# EAGLE design button (EAGLE 7.2.0)
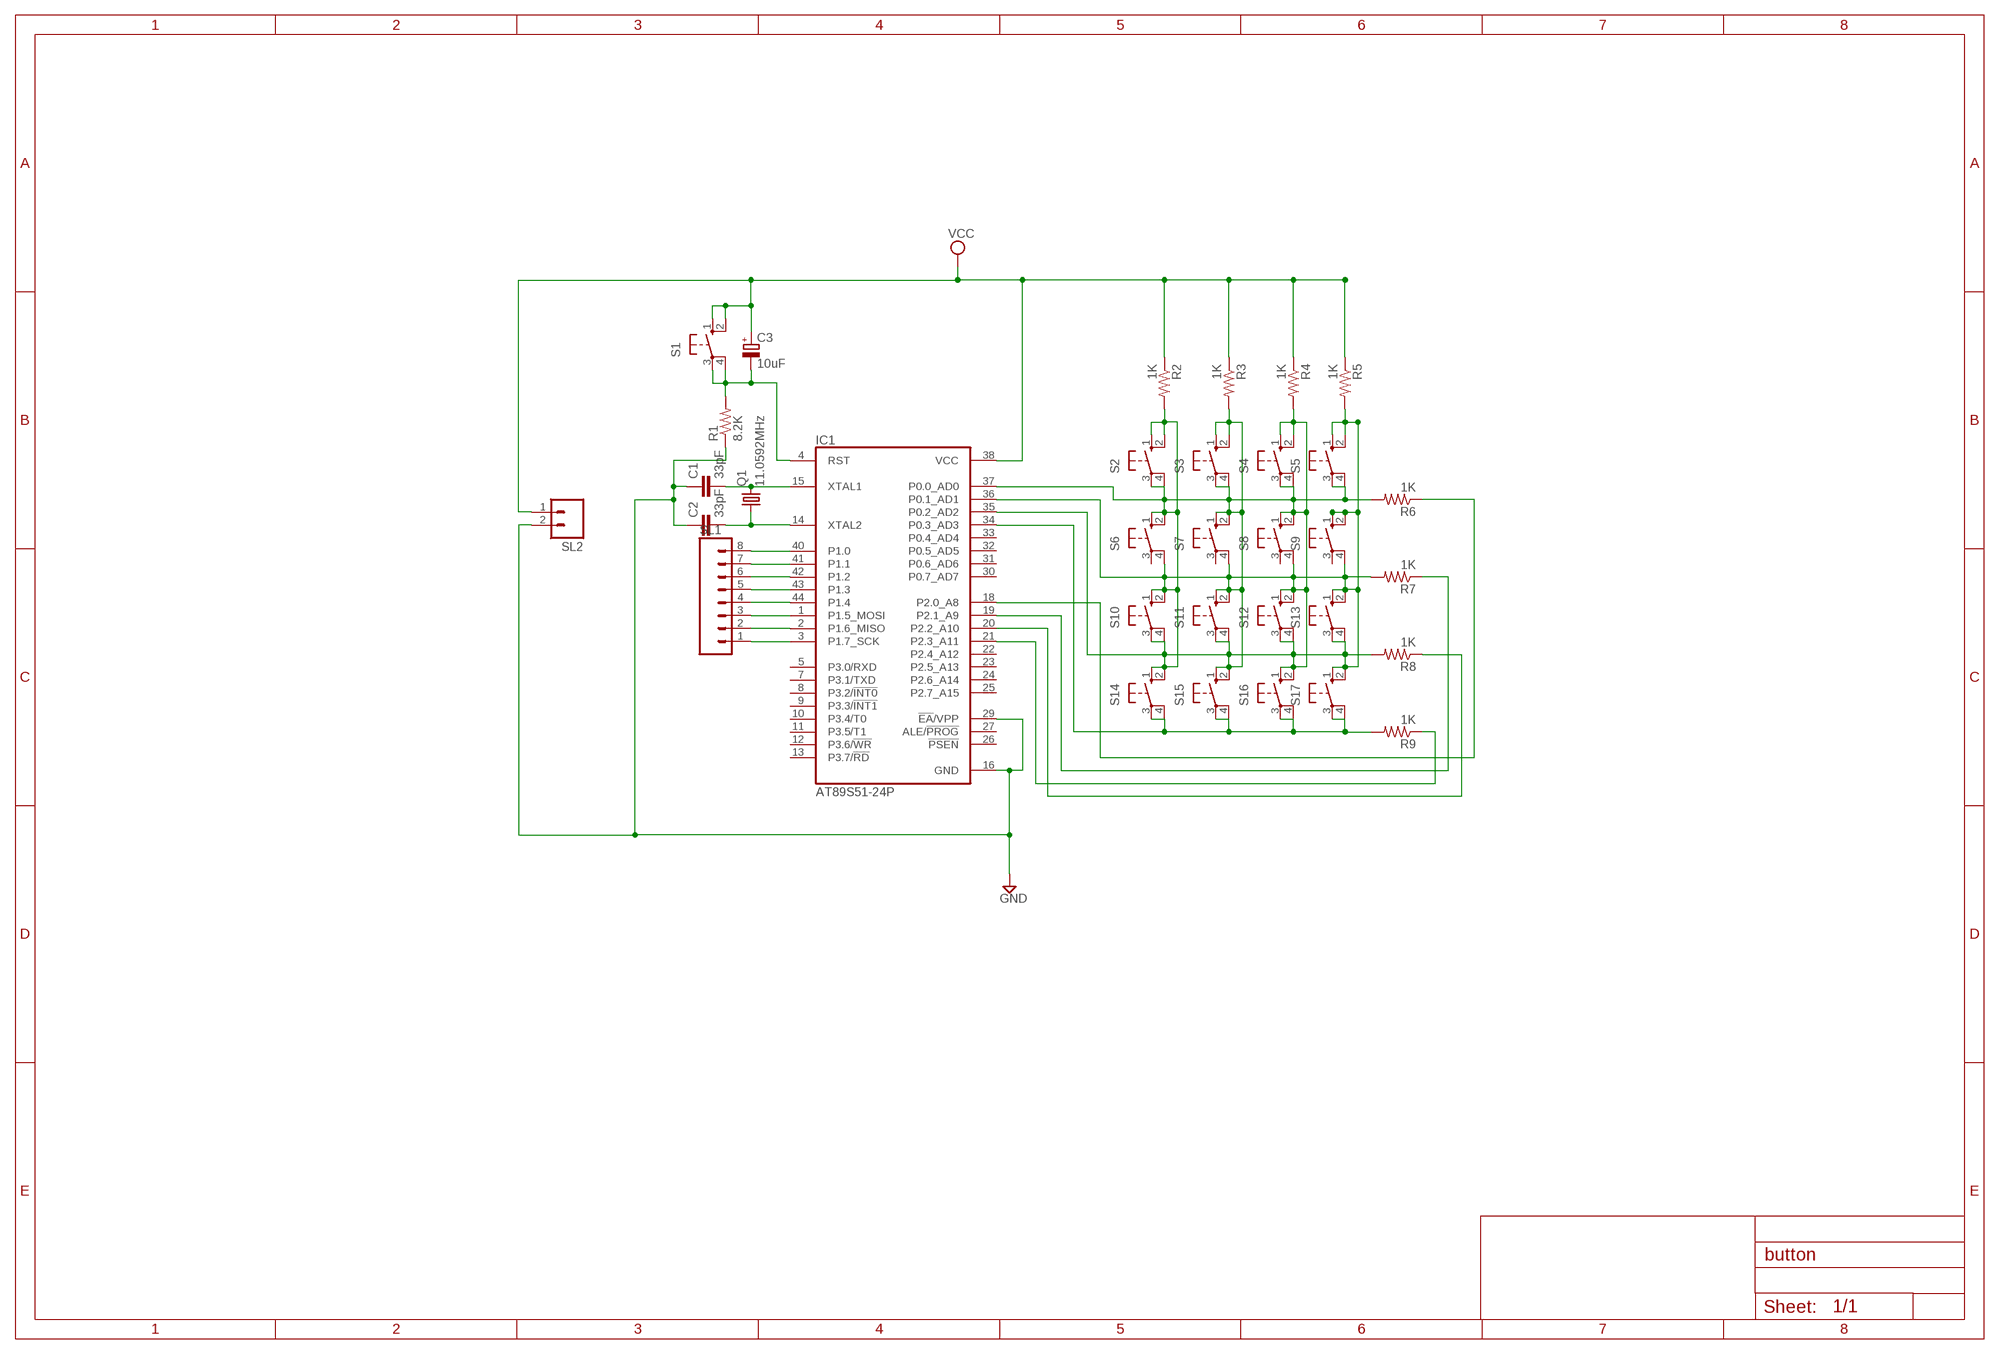
[diagram p0: schematic, sheet 1]

## Parts
C1  33pF  C-EUC1206K  [C1206K]
C2  33pF  C-EUC1206K  [C1206K]
C3  10uF  CPOL-EU140CLH-1010  [140CLH-1010]
IC1  AT89S51-24P  [TQFP44]
Q1  11.0592MHz  CRYSTALTC26V  [TC26V]
R1  8.2K  R-US_R1206  [R1206]
R2  1K  R-US_M1206  [M1206]
R3  1K  R-US_M1206  [M1206]
R4  1K  R-US_M1206  [M1206]
R5  1K  R-US_M1206  [M1206]
R6  1K  R-US_M1206  [M1206]
R7  1K  R-US_M1206  [M1206]
R8  1K  R-US_M1206  [M1206]
R9  1K  R-US_M1206  [M1206]
S1  10-XX  [B3F-10XX]
S2  10-XX  [B3F-10XX]
S3  10-XX  [B3F-10XX]
S4  10-XX  [B3F-10XX]
S5  10-XX  [B3F-10XX]
S6  10-XX  [B3F-10XX]
S7  10-XX  [B3F-10XX]
S8  10-XX  [B3F-10XX]
S9  10-XX  [B3F-10XX]
S10  10-XX  [B3F-10XX]
S11  10-XX  [B3F-10XX]
S12  10-XX  [B3F-10XX]
S13  10-XX  [B3F-10XX]
S14  10-XX  [B3F-10XX]
S15  10-XX  [B3F-10XX]
S16  10-XX  [B3F-10XX]
S17  10-XX  [B3F-10XX]
SL1  MA08  [08PA]
SL2  MA02  [02PA]

## Nets
GND: C1.1 C2.1 IC1.16(GND) IC1.29(!EA!/VPP) R1.1 SL2.2
N$1: C1.2 IC1.15(XTAL1) Q1.2
N$2: C2.2 IC1.14(XTAL2) Q1.1
N$4: C3.- IC1.4(RST) R1.2 S1.3(P) S1.4(P1)
N$5: IC1.41(P1.1) SL1.7
N$6: IC1.42(P1.2) SL1.6
N$7: IC1.43(P1.3) SL1.5
N$9: IC1.40(P1.0) SL1.8
N$10: IC1.44(P1.4) SL1.4
N$11: IC1.1(P1.5_MOSI) SL1.3
N$12: IC1.2(P1.6_MISO) SL1.2
N$13: IC1.3(P1.7_SCK) SL1.1
N$14: IC1.21(P2.3_A11) R9.1
N$15: IC1.20(P2.2_A10) R8.1
N$16: IC1.19(P2.1_A9) R7.1
N$17: IC1.18(P2.0_A8) R6.1
N$21: IC1.35(P0.2_AD2) IC1.36(P0.1_AD1) IC1.37(P0.0_AD0) R2.2 R3.2 R4.2 R5.2 R6.2 R7.2 R8.2 S2.1(S) S2.2(S1) S2.3(P) S2.4(P1) S3.1(S) S3.2(S1) S3.3(P) S3.4(P1) S4.1(S) S4.2(S1) S4.3(P) S4.4(P1) S5.1(S) S5.2(S1) S5.3(P) S5.4(P1) S6.1(S) S6.2(S1) S6.4(P1) S7.1(S) S7.2(S1) S7.4(P1) S8.1(S) S8.2(S1) S8.4(P1) S9.1(S) S9.2(S1) S9.4(P1) S10.1(S) S10.2(S1) S10.3(P) S10.4(P1) S11.1(S) S11.2(S1) S11.3(P) S11.4(P1) S12.1(S) S12.2(S1) S12.3(P) S12.4(P1) S13.1(S) S13.2(S1) S13.3(P) S13.4(P1) S14.1(S) S14.2(S1) S15.1(S) S15.2(S1) S16.1(S) S16.2(S1) S17.1(S) S17.2(S1)
N$43: IC1.34(P0.3_AD3) R9.2 S14.3(P) S14.4(P1) S15.3(P) S15.4(P1) S16.3(P) S16.4(P1) S17.3(P) S17.4(P1)
VCC: C3.+ IC1.38(VCC) R2.1 R3.1 R4.1 R5.1 S1.1(S) S1.2(S1) SL2.1
Unconnected: IC1.5(P3.0/RXD) IC1.7(P3.1/TXD) IC1.8(P3.2/!INT0) IC1.9(P3.3/!INT1) IC1.10(P3.4/T0) IC1.11(P3.5/T1) IC1.12(P3.6/!WR) IC1.13(P3.7/!RD) IC1.22(P2.4_A12) IC1.23(P2.5_A13) IC1.24(P2.6_A14) IC1.25(P2.7_A15) IC1.26(!PSEN) IC1.27(ALE/!PROG) IC1.30(P0.7_AD7) IC1.31(P0.6_AD6) IC1.32(P0.5_AD5) IC1.33(P0.4_AD4) S6.3(P) S7.3(P) S8.3(P) S9.3(P)

## Power pins joined to a net without a drawn wire
GND: IC1.17(GND)

## Library data of the parts
C1 C2 = resistor:C-EU: CAPACITOR, European symbol
C3 = resistor:CPOL-EU: POLARIZED CAPACITOR, European symbol
IC1 = atmel:AT89S51*P: 8-bit Microcontroller with 4K BytesIn-System Programmable Flash Source: http://www.atmel.com/dyn/resources/prod_documents/doc2487.pdf; OC_FARNELL: unknown; OC_NEWARK: unknown
Q1 = crystal:CRYSTAL: CRYSTAL; OC_FARNELL: unknown; OC_NEWARK: unknown
R1-R9 = resistor:R-US_: RESISTOR, American symbol
S1-S17 = switch-omron:10-XX: OMRON SWITCH; MPN: B3F-1000; OC_FARNELL: 176432; OC_NEWARK: 36M3542
SL1 = con-amp-quick:MA08: AMP QUICK CONNECTOR; OC_FARNELL: unknown; OC_NEWARK: unknown
SL2 = con-amp-quick:MA02: AMP QUICK CONNECTOR; OC_FARNELL: unknown; OC_NEWARK: unknown

## Board
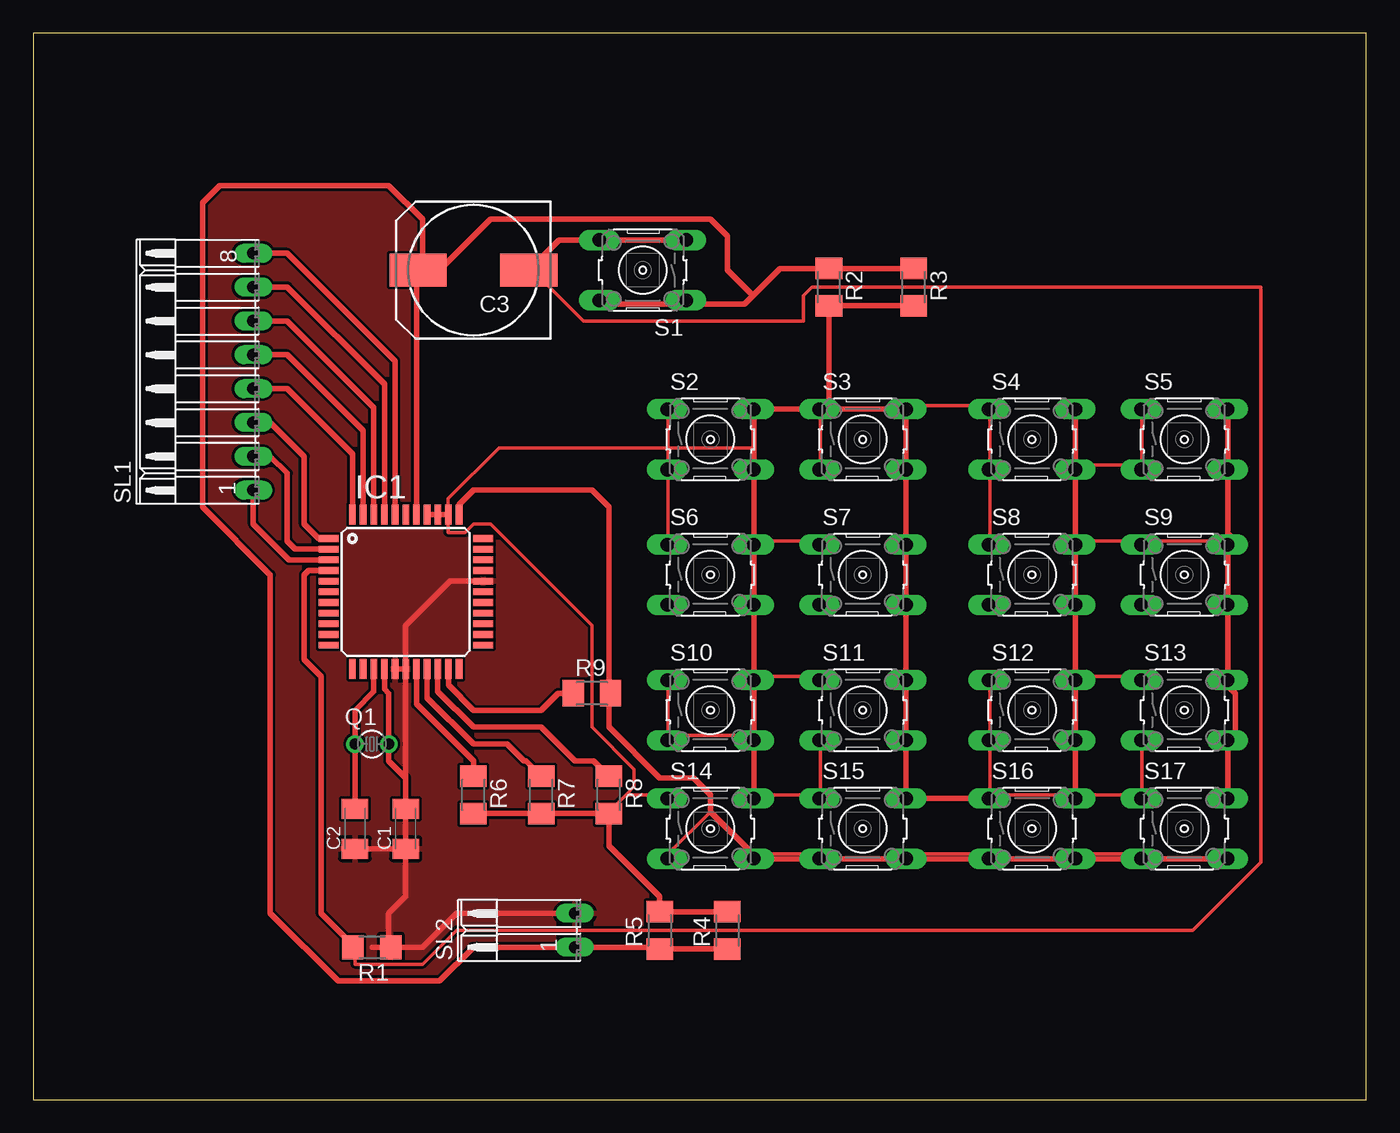
[diagram p1: board, top side]

Size 100 x 80 mm. Coordinates in mm from the lower left corner, seen from the top.
Outline: 0,0 100,0 100,80 0,80 0,0
Copper layers (1*16): Top 0.035mm / dielectric 1.5mm / Bottom 0.035mm
Design rules "default": minimum track width 10mil, minimum drill 24mil, track to track 8mil, track to pad 8mil, pad to pad 8mil, via to via 8mil, smd to smd 8mil, copper to edge 40mil, drill to drill 8mil, minimum pad ring 10mil, minimum via ring 8mil, stop-mask expansion 4mil, vias tented up to drill 0mil, thermal gap 10mil

### Footprints (pad centres in the part's own frame; a part is rotated, then mirrored left to right if it is on the bottom)
C1206K = smd 1.5 x 2: 1 -1.5,0; 2 1.5,0
140CLH-1010 = smd 4.3 x 2.5: + 4.15,0; - -4.15,0
TQFP44 = smd 1.5 x 0.5: 1 -5.8,4; 2 -5.8,3.2; 3 -5.8,2.4; 4 -5.8,1.6; 5 -5.8,0.8; 6 -5.8,0; 7 -5.8,-0.8; 8 -5.8,-1.6; 9 -5.8,-2.4; 10 -5.8,-3.2; 11 -5.8,-4; 23 5.8,-4; 24 5.8,-3.2; 25 5.8,-2.4; 26 5.8,-1.6; 27 5.8,-0.8; 28 5.8,0; 29 5.8,0.8; 30 5.8,1.6; 31 5.8,2.4; 32 5.8,3.2; 33 5.8,4 | smd 0.5 x 1.5: 12 -4,-5.8; 13 -3.2,-5.8; 14 -2.4,-5.8; 15 -1.6,-5.8; 16 -0.8,-5.8; 17 0,-5.8; 18 0.8,-5.8; 19 1.6,-5.8; 20 2.4,-5.8; 21 3.2,-5.8; 22 4,-5.8; 34 4,5.8; 35 3.2,5.8; 36 2.4,5.8; 37 1.6,5.8; 38 0.8,5.8; 39 0,5.8; 40 -0.8,5.8; 41 -1.6,5.8; 42 -2.4,5.8; 43 -3.2,5.8; 44 -4,5.8
TC26V = drill 0.813: 1 -1.27,0; 2 1.27,0
R1206 = smd 1.6 x 1.803: 1 -1.422,0; 2 1.422,0
M1206 = smd 1.6 x 2: 1 -1.4,0; 2 1.4,0
B3F-10XX = drill 1.016 long: 1 -3.251,2.261; 2 3.251,2.261; 3 -3.251,-2.261; 4 3.251,-2.261
08PA = drill 0.914 long: 1 -8.89,0; 2 -6.35,0; 3 -3.81,0; 4 -1.27,0; 5 1.27,0; 6 3.81,0; 7 6.35,0; 8 8.89,0
02PA = drill 0.914 long: 1 -1.27,0; 2 1.27,0

### Placement (x,y rotation side)
C1  27.94,20.32 90 top
C2  24.13,20.32 90 top
C3  33.02,62.23 180 top
IC1  27.94,38.1 0 top
Q1  25.4,26.67 0 top
R1  25.4,11.43 180 top
R2  59.69,60.96 270 top
R3  66.04,60.96 270 top
R4  52.07,12.7 90 top
R5  46.99,12.7 90 top
R6  33.02,22.86 270 top
R7  38.1,22.86 270 top
R8  43.18,22.86 270 top
R9  41.91,30.48 0 top
S1  45.72,62.23 180 top
S2  50.8,49.53 0 top
S3  62.23,49.53 0 top
S4  74.93,49.53 0 top
S5  86.36,49.53 0 top
S6  50.8,39.37 0 top
S7  62.23,39.37 0 top
S8  74.93,39.37 0 top
S9  86.36,39.37 0 top
S10  50.8,29.21 0 top
S11  62.23,29.21 0 top
S12  74.93,29.21 0 top
S13  86.36,29.21 0 top
S14  50.8,20.32 0 top
S15  62.23,20.32 0 top
S16  74.93,20.32 0 top
S17  86.36,20.32 0 top
SL1  16.51,54.61 90 top
SL2  40.64,12.7 90 top

### Tracks (layer width: path | path; a pad name or v marks a point on that pad's centre or on a via)
GND
  Top 0.406: C1.1 C2.1 | C1.1 27.94,15.24 26.67,13.97 26.67,11.58 R1.1 | IC1.16 IC1.17 | IC1.17 27.94,35.56 31.28,38.9 IC1.29 | C1.1 IC1.17 | SL2.2 31.75,13.97 29.21,11.43 R1.1 | 25.4,11.43 R1.1
  pour Top: 5.08,69.85 5.08,5.08 95.25,5.08 95.25,7.62 95.25,69.85
N$1
  Top 0.406: IC1.15 26.34,30.81 26.67,30.48 Q1.2 26.67,25.4 27.94,24.13 C1.2 27.94,21.59
N$2
  Top 0.406: IC1.14 25.54,30.62 24.13,29.21 Q1.1 C2.2
N$4
  Top 0.254: C3.- 37.47,62.23 41.27,58.42 57.78,58.42 57.78,60.33 58.42,60.96 92.08,60.96 92.08,17.78 87,12.7 31.75,12.7 29.21,10.16 24.13,10.16 24.13,11.43 R1.2
  Top 0.406: R1.2 23.98,11.58 21.59,13.97 21.59,31.75 20.32,33.02 20.32,39.37 20.65,39.7 IC1.4 | C3.- 39.43,64.49 S1.4 S1.3
N$5
  Top 0.406: IC1.41 26.34,53.67 19.05,60.96 SL1.7
N$6
  Top 0.406: IC1.42 25.54,51.93 19.05,58.42 SL1.6
N$7
  Top 0.406: IC1.43 24.74,50.19 19.05,55.88 SL1.5
N$9
  Top 0.406: IC1.40 27.14,55.41 19.05,63.5 SL1.8
N$10
  Top 0.406: IC1.44 23.94,48.45 19.05,53.34 SL1.4
N$11
  Top 0.254: 17.78,50.8 SL1.3
  Top 0.406: IC1.1 21.4,42.1 20.32,43.18 20.32,48.26 17.78,50.8
N$12
  Top 0.406: IC1.2 19.66,41.3 19.05,41.91 19.05,46.99 17.78,48.26 SL1.2
N$13
  Top 0.406: IC1.3 19.19,40.5 16.51,43.18 SL1.1
N$14
  Top 0.406: IC1.21 31.14,31.09 33.02,29.21 38.1,29.21 39.37,30.48 R9.1
N$15
  Top 0.406: IC1.20 30.34,30.62 33.02,27.94 38.1,27.94 40.64,25.4 42.04,25.4 R8.1
N$16
  Top 0.406: IC1.19 29.54,30.15 33.02,26.67 35.56,26.67 36.83,25.4 36.96,25.4 R7.1
N$17
  Top 0.406: IC1.18 28.74,29.68 33.02,25.4 R6.1
N$21
  Top 0.254: S8.2 78.74,41.91 82.55,41.91 S9.1 83.19,41.91 89.53,41.91 S9.2 90.17,41.91 | S13.2 89.53,31.75 89.61,31.75 | 54.05,48.9 47.62,48.9 | 47.62,48.9 34.92,48.9 31.11,45.09 31.11,44.45 IC1.35 31.11,43.81 31.11,42.55 32.38,42.55 33.02,43.18 34.29,43.18 41.91,35.56 41.91,27.94 45.09,24.77 45.09,23.5 44.45,22.86 | 44.45,22.86 43.18,21.59 R8.2 | S5.1 83.19,51.44 83.19,47.62 S5.3 82.55,47.62 78.74,47.62 S4.4 | S13.1 82.55,31.75 78.74,31.75 S12.2 | S13.3 83.19,26.67 83.19,22.86 S17.1 82.55,22.86 78.74,22.86 S16.2 78.11,22.86 72.39,22.86 | S8.1 71.75,41.91 71.75,46.99 S4.3 71.75,47.62 71.75,51.44 S4.1 71.12,52.07 66.04,52.07 S3.2 | S6.1 47.62,41.91 47.62,46.99 S2.3 47.62,47.62 47.62,48.9 | S3.3 59.05,47.62 59.05,51.44 S3.1 59.05,52.07 | S12.1 71.75,31.11 71.75,27.3 S12.3 71.75,26.67 71.75,22.86 | 47.62,27.3 47.62,31.11 S10.1 | S11.3 59.05,26.67 59.05,22.86 S15.1 58.42,22.86 54.61,22.86 S14.2 | 44.45,22.86 46.99,22.86 S14.1 | 47.62,48.9 47.62,51.44 S2.1 | S11.1 58.42,31.75 54.61,31.75 S10.2 | S7.1 58.42,41.91 54.61,41.91 S6.2 | 72.39,22.86 71.75,22.86 | 47.62,27.3 53.98,27.3 S10.4 | 47.62,27.3 S10.3 | 71.75,22.86 S16.1 72.39,22.86
  Top 0.406: R6.2 R7.2 R8.2 43.18,19.05 46.99,15.24 R5.2 R4.2 | S2.2 54.61,51.79 | 54.61,51.79 58.14,51.79 58.42,52.07 59.05,52.07 59.69,52.07 | 54.61,51.79 54.05,51.23 54.05,48.9 S2.4 S6.2 S6.4 S10.2 S10.4 S14.2 | 59.69,52.07 59.97,51.79 S3.2 S3.4 S7.2 S7.4 S11.2 65.48,27.38 64.77,26.67 65.2,26.67 S11.4 S15.2 S16.1 72.11,22.58 72.39,22.86 | S16.2 S12.4 S12.2 S8.4 S8.2 S4.4 S4.2 | 90.17,41.91 89.61,42.47 S5.4 S5.2 | S9.2 S9.4 89.61,31.75 S13.2 89.61,31.04 90.17,30.48 90.17,27.51 S13.4 S17.2 | IC1.37 IC1.36 IC1.35 | 59.69,52.07 R2.2 | R2.2 59.69,59.69 | R3.2 R2.2
N$43
  Top 0.254: 50.8,21.59 47.62,18.41 S14.3 | S15.3 58.42,18.41 54.61,18.41 S14.4 | S16.3 71.12,18.41 66.04,18.41 S15.4 | S17.3 82.55,18.41 78.74,18.41 S16.4
  Top 0.406: S17.4 S17.3 S16.4 S16.3 66.32,18.06 66.04,17.78 65.76,17.78 S15.4 S15.3 S14.4 54.05,18.34 50.8,21.59 50.8,22.86 49.53,24.13 46.99,24.13 43.18,27.94 43.18,30.35 R9.2 43.18,30.61 43.18,44.45 41.91,45.72 33.02,45.72 31.94,44.64 IC1.34
VCC
  Top 0.406: R4.1 R5.1 46.86,11.43 SL2.1 33.02,11.43 30.48,8.89 22.86,8.89 17.78,13.97 17.78,39.37 12.7,44.45 12.7,67.31 13.97,68.58 26.67,68.58 29.21,66.04 29.21,62.57 C3.+ | R3.1 R2.1 56.01,62.36 53.98,60.33 | 53.98,60.33 53.34,59.69 49.53,59.69 | 49.53,59.69 49.25,59.69 | 49.25,59.69 S1.1 49.25,59.97 49.53,59.69 | 49.25,59.69 42.75,59.69 S1.2 | C3.+ 30.48,62.23 34.29,66.04 50.8,66.04 52.07,64.77 52.07,62.23 53.98,60.33 | IC1.38 28.74,62.1 C3.+